# Altium schematic sheet K60.SchDoc
size A4
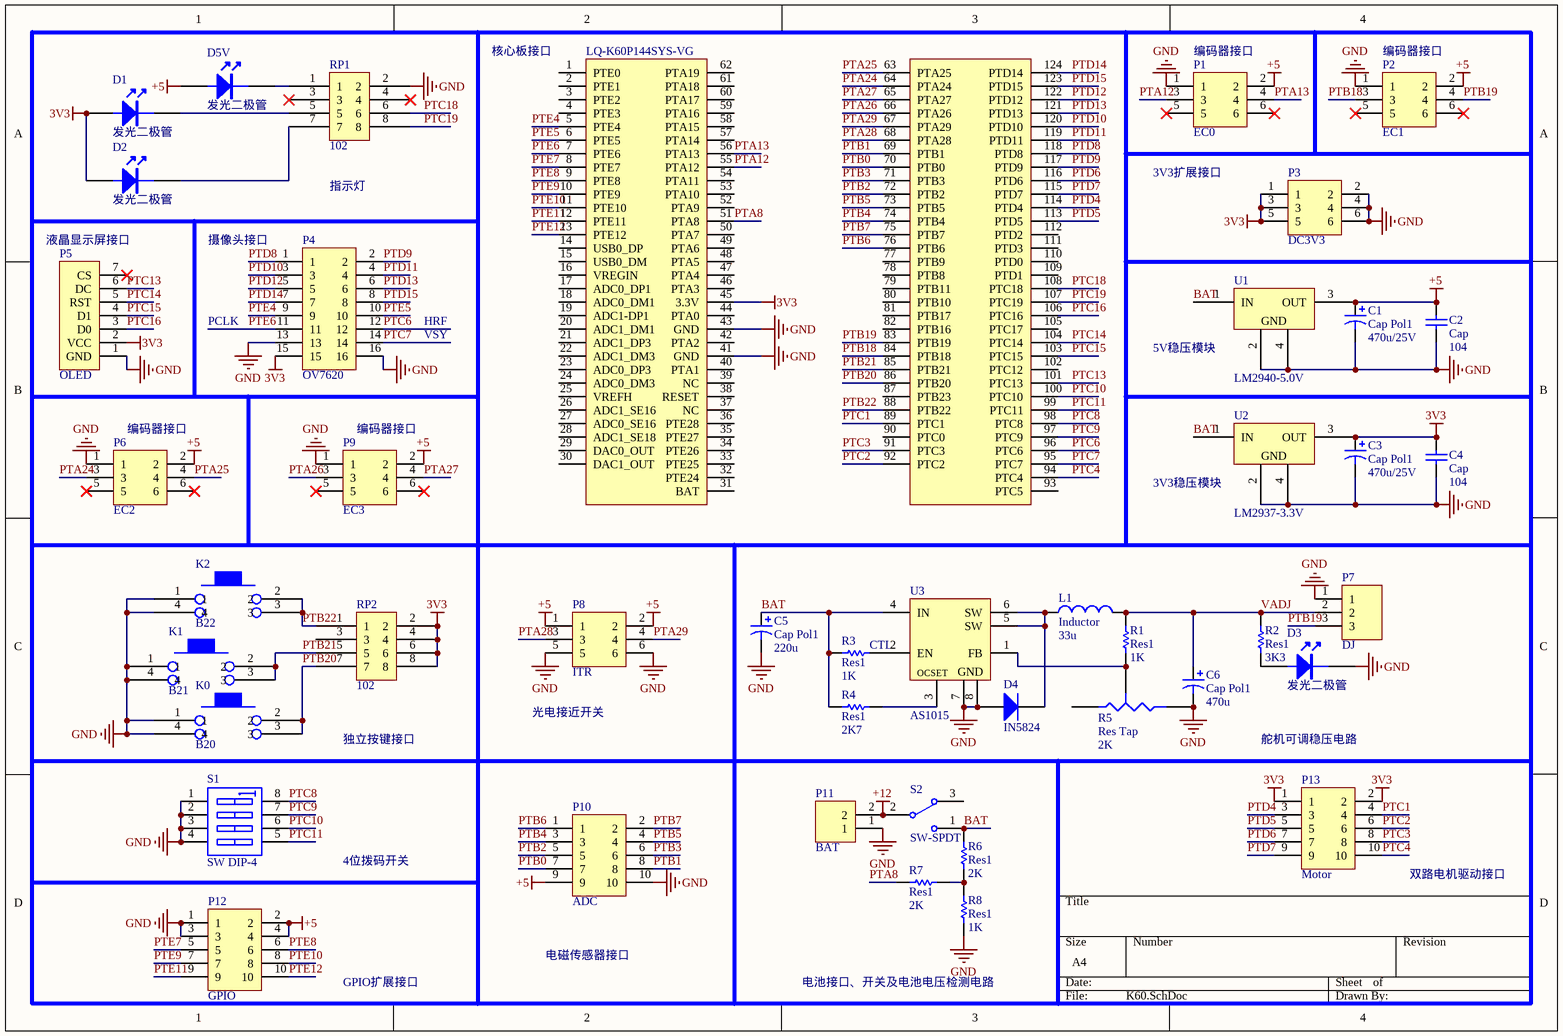
[diagram p0: K60.SchDoc]

## Parts
C1  Cap Pol1  value 470u/25V  [CT 8*7 - C]
C2  Cap  value 104  [0603]
C3  Cap Pol1  value 470u/25V  [CT 8*7 - C]
C4  Cap  value 104  [0603]
C5  Cap Pol1  value 220u  [CT 8*7 - C]
C6  Cap Pol1  value 470u  [CT 8*7 - C]
D1  发光二极管  [0603]
D2  发光二极管  [0603]
D3  发光二极管  [0603]
D4  IN5824  [SMA]
D5V  发光二极管  [0603]
K0  B20  [TSW DIP-6*6*6]
K1  B21  [TSW DIP-6*6*6]
K2  B22  [TSW DIP-6*6*6]
L1  Inductor  value 33u  [CDRH127]
LQ-K60P144SYS-VG  (no value)  [LQ_KXXP144-SYSVG]
P1  EC0  [2.54排针2X3]
P2  EC1  [2.54排针2X3]
P3  DC3V3  [2.54排针2X3]
P4  OV7620  [2.54排针2X8]
P5  OLED  [HDR1X7]
P6  EC2  [2.54排针2X3]
P7  DJ  [2.54排针1X3]
P8  ITR  [2.54排针2X3]
P9  EC3  [2.54排针2X3]
P10  ADC  [2.54排针2X5]
P11  BAT  [KF301-2P]
P12  GPIO  [2.54排针2X5]
P13  Motor  [2.54排针2X5]
R1  Res1  value 1K  [0603]
R2  Res1  value 3K3  [0603]
R3  Res1  value 1K  [0603]
R4  Res1  value 2K7  [0603]
R5  Res Tap  value 2K  [VR_A1]
R6  Res1  value 2K  [0603]
R7  Res1  value 2K  [0603]
R8  Res1  value 1K  [0603]
RP1  102  [8P4R_0603]
RP2  102  [8P4R_0603]
S1  SW DIP-4  [BMKG4]
S2  SW-SPDT  [SW3-H2X3_8.6X4.5_L]
U1  LM2940-5.0V  [TO-263-3]
U2  LM2937-3.3V  [TO-263-3]
U3  AS1015  [NSO8_N]

## Nets
3V3: C3.1 C4.2 D1.1(A) D2.1(A) LQ-K60P144SYS-VG.45(3.3V) P3.1 P3.3 P3.5 P4.15 P5.2(VCC) P13.1 P13.2 RP2.2 RP2.4 RP2.6 RP2.8 U2.3(OUT)
+5: C1.1 C2.2 D5V.1(A) P1.2 P2.2 P6.2 P8.1 P8.2 P9.2 P10.9 P12.2 P12.4 U1.3(OUT)
+12: P11.2 S2.2
GND: C1.2 C2.1 C3.2 C4.1 C5.2 C6.2 D3.2(K) D4.1(A) K0.1 K0.4 K1.1 K1.4 K2.1 K2.4 LQ-K60P144SYS-VG.41(GND) LQ-K60P144SYS-VG.43(GND) P1.1 P2.1 P3.2 P3.4 P3.6 P4.13 P4.16 P5.1(GND) P6.1 P7.1 P8.5 P8.6 P9.1 P10.10 P11.1 P12.1 P12.3 R5.2(B) R8.1 RP1.2 S1.1(A1) S1.2(A2) S1.3(A3) S1.4(A4) U1.2(GND) U1.4(GND) U2.2(GND) U2.4(GND) U3.7(GND) U3.8(GND)
BAT: C5.1 R3.1 R4.1 R6.2 S2.1 U1.1(IN) U2.1(IN) U3.4(IN)
PTA8: LQ-K60P144SYS-VG.51(PTA8) R7.1
PTA12: LQ-K60P144SYS-VG.55(PTA12) P1.3
PTA13: LQ-K60P144SYS-VG.56(PTA13) P1.4
PTA24: LQ-K60P144SYS-VG.64(PTA24) P6.3
PTA25: LQ-K60P144SYS-VG.63(PTA25) P6.4
PTA26: LQ-K60P144SYS-VG.66(PTA26) P9.3
PTA27: LQ-K60P144SYS-VG.65(PTA27) P9.4
PTA28: LQ-K60P144SYS-VG.68(PTA28) P8.3
PTA29: LQ-K60P144SYS-VG.67(PTA29) P8.4
PTB0: LQ-K60P144SYS-VG.70(PTB0) P10.7
PTB1: LQ-K60P144SYS-VG.69(PTB1) P10.8
PTB2: LQ-K60P144SYS-VG.72(PTB2) P10.5
PTB3: LQ-K60P144SYS-VG.71(PTB3) P10.6
PTB4: LQ-K60P144SYS-VG.74(PTB4) P10.3
PTB5: LQ-K60P144SYS-VG.73(PTB5) P10.4
PTB6: LQ-K60P144SYS-VG.76(PTB6) P10.1
PTB7: LQ-K60P144SYS-VG.75(PTB7) P10.2
PTB18: LQ-K60P144SYS-VG.84(PTB18) P2.3
PTB19: LQ-K60P144SYS-VG.83(PTB19) P2.4 P7.3
PTB20: K0.2 K0.3 LQ-K60P144SYS-VG.86(PTB20) RP2.7
PTB21: K1.2 K1.3 LQ-K60P144SYS-VG.85(PTB21) RP2.5
PTB22: K2.2 K2.3 LQ-K60P144SYS-VG.88(PTB22) RP2.1
PTC1: LQ-K60P144SYS-VG.89(PTC1) P13.4
PTC2: LQ-K60P144SYS-VG.92(PTC2) P13.6
PTC3: LQ-K60P144SYS-VG.91(PTC3) P13.8
PTC4: LQ-K60P144SYS-VG.94(PTC4) P13.10
PTC6: LQ-K60P144SYS-VG.96(PTC6) P4.12
PTC7: LQ-K60P144SYS-VG.95(PTC7) P4.14
PTC8: LQ-K60P144SYS-VG.98(PTC8) S1.8(B1)
PTC9: LQ-K60P144SYS-VG.97(PTC9) S1.7(B2)
PTC10: LQ-K60P144SYS-VG.100(PTC10) S1.6(B3)
PTC11: LQ-K60P144SYS-VG.99(PTC11) S1.5(B4)
PTC13: LQ-K60P144SYS-VG.101(PTC13) P5.6(DC)
PTC14: LQ-K60P144SYS-VG.104(PTC14) P5.5(RST)
PTC15: LQ-K60P144SYS-VG.103(PTC15) P5.4(D1)
PTC16: LQ-K60P144SYS-VG.106(PTC16) P5.3(D0)
PTC18: LQ-K60P144SYS-VG.108(PTC18) RP1.6
PTC19: LQ-K60P144SYS-VG.107(PTC19) RP1.8
PTD4: LQ-K60P144SYS-VG.114(PTD4) P13.3
PTD5: LQ-K60P144SYS-VG.113(PTD5) P13.5
PTD6: LQ-K60P144SYS-VG.116(PTD6) P13.7
PTD7: LQ-K60P144SYS-VG.115(PTD7) P13.9
PTD8: LQ-K60P144SYS-VG.118(PTD8) P4.1
PTD9: LQ-K60P144SYS-VG.117(PTD9) P4.2
PTD10: LQ-K60P144SYS-VG.120(PTD10) P4.3
PTD11: LQ-K60P144SYS-VG.119(PTD11) P4.4
PTD12: LQ-K60P144SYS-VG.122(PTD12) P4.5
PTD13: LQ-K60P144SYS-VG.121(PTD13) P4.6
PTD14: LQ-K60P144SYS-VG.124(PTD14) P4.7
PTD15: LQ-K60P144SYS-VG.123(PTD15) P4.8
PTE4: LQ-K60P144SYS-VG.5(PTE4) P4.9
PTE5: LQ-K60P144SYS-VG.6(PTE5) P4.10
PTE6: LQ-K60P144SYS-VG.7(PTE6) P4.11
PTE7: LQ-K60P144SYS-VG.8(PTE7) P12.5
PTE8: LQ-K60P144SYS-VG.9(PTE8) P12.6
PTE9: LQ-K60P144SYS-VG.10(PTE9) P12.7
PTE10: LQ-K60P144SYS-VG.11(PTE10) P12.8
PTE11: LQ-K60P144SYS-VG.12(PTE11) P12.9
PTE12: LQ-K60P144SYS-VG.13(PTE12) P12.10
VADJ: C6.1 L1.2 P7.2 R1.2 R2.2
NetD1_2: D1.2(K) RP1.5
NetD2_2: D2.2(K) RP1.7
NetD3_1: D3.1(A) R2.1
NetD4_2: D4.2(K) L1.1 U3.5(SW) U3.6(SW)
NetD5V_2: D5V.2(K) RP1.1
NetR1_1: R1.1 R5.3(TAP) U3.1(FB)
NetR3_2: R3.2 U3.2(EN)
NetR4_2: R4.2 U3.3(OCSET)
NetR6_1: R6.1 R7.2 R8.2

Not connected (* = marked no-connect by the designer): LQ-K60P144SYS-VG 1(PTE0) 2(PTE1) 3(PTE2) 4(PTE3) 14(USB0_DP) 15(USB0_DM) 16(VREGIN) 17(ADC0_DP1) 18(ADC0_DM1) 19(ADC1-DP1) 20(ADC1_DM1) 21(ADC1_DP3) 22(ADC1_DM3) 23(ADC0_DP3) 24(ADC0_DM3) 25(VREFH) 26(ADC1_SE16) 27(ADC0_SE16) 28(ADC1_SE18) 29(DAC0_OUT) 30(DAC1_OUT) 31(BAT) 32(PTE24) 33(PTE25) 34(PTE26) 35(PTE27) 36(PTE28) 37(NC) 38(RESET) 39(NC) 40(PTA1) 42(PTA2) 44(PTA0) 46(PTA3) 47(PTA4) 48(PTA5) 49(PTA6) 50(PTA7) 52(PTA9) 53(PTA10) 54(PTA11) 57(PTA14) 58(PTA15) 59(PTA16) 60(PTA17) 61(PTA18) 62(PTA19) 77(PTB9) 78(PTB8) 79(PTB11) 80(PTB10) 81(PTB17) 82(PTB16) 87(PTB23) 90(PTC0) 93(PTC5) 102(PTC12) 105(PTC17) 109(PTD1) 110(PTD0) 111(PTD3) 112(PTD2); P1 5* 6*; P2 5* 6*; P5 7(CS)*; P6 5* 6*; P9 5* 6*; R5 1(A); RP1 3* 4*; RP2 3; S2 3

## Notes on the sheet
- 核心板接口
- (near P1) 编码器接口
- (near P2) 编码器接口
- 3V3扩展接口
- (near P5) 液晶显示屏接口
- 摄像头接口
- 指示灯
- PCLK
- HRF
- VSY
- (near U1) 5V稳压模块
- (near P6) 编码器接口
- (near P9) 编码器接口
- (near U2) 3V3稳压模块
- (near R3) CTL
- 光电接近开关
- 独立按键接口
- 舵机可调稳压电路
- 4位拨码开关
- 双路电机驱动接口
- GPIO扩展接口
- 电磁传感器接口
- 电池接口、开关及电池电压检测电路

## Library data of the parts
C1 C3 C5 C6 = Cap Pol1: Polarized Capacitor (Radial); Published: 8-Jun-2000; LatestRevisionDate: 17-Jul-2002; LatestRevisionNote: Re-released for DXP Platform.; PackageReference: RB7.6-15; Publisher: Altium Limited; PackageDescription: Polarized Capacitor (Radial); 2 Leads
C2 C4 = Cap: Capacitor; Published: 8-Jun-2000; LatestRevisionDate: 17-Jul-2002; LatestRevisionNote: Re-released for DXP Platform.; PackageReference: RAD-0.3; Publisher: Altium Limited; PackageDescription: Radial Cap, Thru-Hole; 2 Leads; 0.3 in Pin Spacing
D4 = Diode: SS54; Published: 8-Jun-2000; LatestRevisionDate: 17-Jul-2002; LatestRevisionNote: Re-released for DXP Platform.; PackageVersion: Sep-1996; PackageReference: SMC; Publisher: Altium Limited; PackageDescription: DO-214-AB/SMC; 2 C-Bend Leads; Body 7.9 x 5.9 mm, inc. leads (LxW); Code_JEDEC: DO-214-AB
K0-K2 = key
L1 = Inductor: Code_IEC: 1005; Published: 8-Jun-2000; LatestRevisionDate: 29-May-2009; LatestRevisionNote: IPC-7351 Footprint Added.; PackageReference: 0402-A; Publisher: Altium Limited; PackageDescription: Chip Inductor; Code_JEITA: 0402
LQ-K60P144SYS-VG = LQ_KXXP144-SYSVG
P1-P3 P6 P8 P9 = Header 3X2: Header, 3-Pin, Dual row; LatestRevisionDate: 17-Jul-2002; LatestRevisionNote: Re-released for DXP Platform.; Publisher: Altium Limited
P4 = Header 8X2: Header, 8-Pin, Dual row; LatestRevisionDate: 17-Jul-2002; LatestRevisionNote: Re-released for DXP Platform.; Publisher: Altium Limited
P5 = Header 7: Header, 7-Pin; LatestRevisionDate: 17-Jul-2002; LatestRevisionNote: Re-released for DXP Platform.; Publisher: Altium Limited
P7 = Header 3: Header, 3-Pin; LatestRevisionDate: 17-Jul-2002; LatestRevisionNote: Re-released for DXP Platform.; Publisher: Altium Limited
P10 P12 P13 = Header 5X2: Header, 5-Pin, Dual row; LatestRevisionDate: 17-Jul-2002; LatestRevisionNote: Re-released for DXP Platform.; Publisher: Altium Limited
P11 = Header 2: Header, 2-Pin; LatestRevisionDate: 17-Jul-2002; LatestRevisionNote: Re-released for DXP Platform.; Publisher: Altium Limited
R1-R4 R6-R8 = Res1: Resistor; Published: 8-Jun-2000; LatestRevisionDate: 17-Jul-2002; LatestRevisionNote: Re-released for DXP Platform.; PackageReference: AXIAL-0.3; Publisher: Altium Limited; PackageDescription: Axial Device, Thru-Hole; 2 Leads; 0.3 in Pin Spacing
R5 = Res Tap: Tapped Resistor; Sim Note: Enter the Resistance value and the set point into parameter fields.; Set Position: 0.5; Published: 24-Mar-1999; LatestRevisionDate: 17-Jul-2002; LatestRevisionNote: Re-released for DXP Platform.; PackageReference: VR3; Publisher: Altium Limited; PackageDescription: Variable Resistor, Thru-Hole; 3 Leads
RP1 RP2 = Res Pak-8
S1 = SW DIP-4: DIP Switch, 4 Position, SPST; Published: 24-Mar-1999; LatestRevisionDate: 29-May-2009; LatestRevisionNote: IPC-7351 Footprint Added.; PackageVersion: Dec-2002; PackageReference: SO8; Publisher: Altium Limited; PackageDescription: 8-Pin Small Outline Integrated Circuit 1.27 mm Pitch; Code_JEDEC: MS-012-AA; Code_IPC: SOIC127P600-8
S2 = SW-SPDT: SPDT Subminiature Toggle Switch, Right Angle Mounting, Vertical Actuation; Published: 24-Mar-1999; LatestRevisionDate: 17-Dec-2003; LatestRevisionNote: Schematic revised, PCB Footprint replaced.; DatasheetVersion: 05-Dec-2000; PackageReference: TL36WW15050; Publisher: Altium Limited; PackageDescription: Switch; 4 Leads; ComponentLink1Description: Manufacturer Link; ComponentLink1URL: http://www.apem.com
U1 U2 = LM2940: 5V稳压芯片
U3 = AS1015: 可调升压芯片